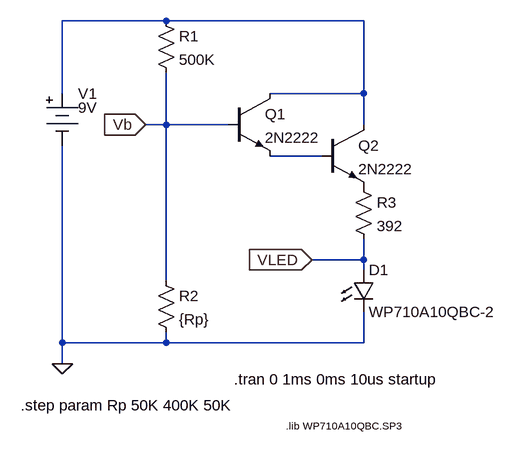
[diagram p0: schematic Photosensor.asc]
Photosensor.asc, the LTspice schematic file:
Version 4
SHEET 1 936 680
WIRE 16 -16 -144 -16
WIRE 320 -16 16 -16
WIRE -144 96 -144 -16
WIRE 320 96 320 -16
WIRE 320 96 176 96
WIRE 16 144 16 64
WIRE 16 144 -16 144
WIRE 112 144 16 144
WIRE 320 144 320 96
WIRE 256 192 176 192
WIRE 320 352 320 320
WIRE 320 352 240 352
WIRE 320 368 320 352
WIRE 16 384 16 144
WIRE -144 480 -144 176
WIRE 16 480 16 464
WIRE 16 480 -144 480
WIRE 320 480 320 432
WIRE 320 480 16 480
WIRE -144 512 -144 480
FLAG -144 512 0
FLAG -16 144 Vb
IOPIN -16 144 In
FLAG 240 352 VLED
IOPIN 240 352 In
SYMBOL battery -144 80 R0
WINDOW 123 0 0 Left 2
WINDOW 3 24 38 Left 2
SYMATTR Value 9V
SYMATTR InstName V1
SYMATTR SpiceLine Rser=0
SYMBOL res 0 -32 R0
SYMATTR InstName R1
SYMATTR Value 500K
SYMBOL res 0 368 R0
SYMATTR InstName R2
SYMATTR Value {Rp}
SYMBOL res 304 224 R0
SYMATTR InstName R3
SYMATTR Value 392
SYMBOL npn 112 96 R0
SYMATTR InstName Q1
SYMATTR Value 2N2222
SYMBOL npn 256 144 R0
SYMATTR InstName Q2
SYMATTR Value 2N2222
SYMBOL LED 304 368 R0
SYMATTR InstName D1
SYMATTR Value WP710A10QBC-2
TEXT 200 608 Left 1 !.lib WP710A10QBC.SP3
TEXT 120 536 Left 2 !.tran 0 1ms 0ms 10us startup
TEXT -208 576 Left 2 !.step param Rp 50K 400K 50K

The netlist it stands for:
* Photosensor.asc
V1 N001 0 9V Rser=0
R1 N001 Vb 500K
R2 Vb 0 {Rp}
R3 P001 VLED 392
Q1 N001 Vb N002 0 2N2222
Q2 N001 N002 P001 0 2N2222
D1 VLED 0 WP710A10QBC-2
.model D D
.lib standard.dio
.model NPN NPN
.model PNP PNP
.lib standard.bjt
.lib WP710A10QBC.SP3
.tran 0 1ms 0ms 10us startup
.step param Rp 50K 400K 50K
.backanno
.end